# Altium schematic sheet SCH_LTDZXM-8814 _MCU20181113(1).SchDoc
size C; SheetNumber: 0; SheetTotal: 0; PageSetup: Record=PageOptions|CenterHorizontal=True|CenterVertical=True|PrintScale=1.00|XCorrection=1.00|YCorrection=1.00|PrintKind=0|BorderSize=5000000|LeftOffset=0|BottomOffset=0|Orientation=2|PaperLength=1000|PaperWidth=1000|Scale=100|PaperSource=7|PrintQuality=-4|MediaType=1|DitherType=10|PrintScaleMode=1|PaperKind=A4
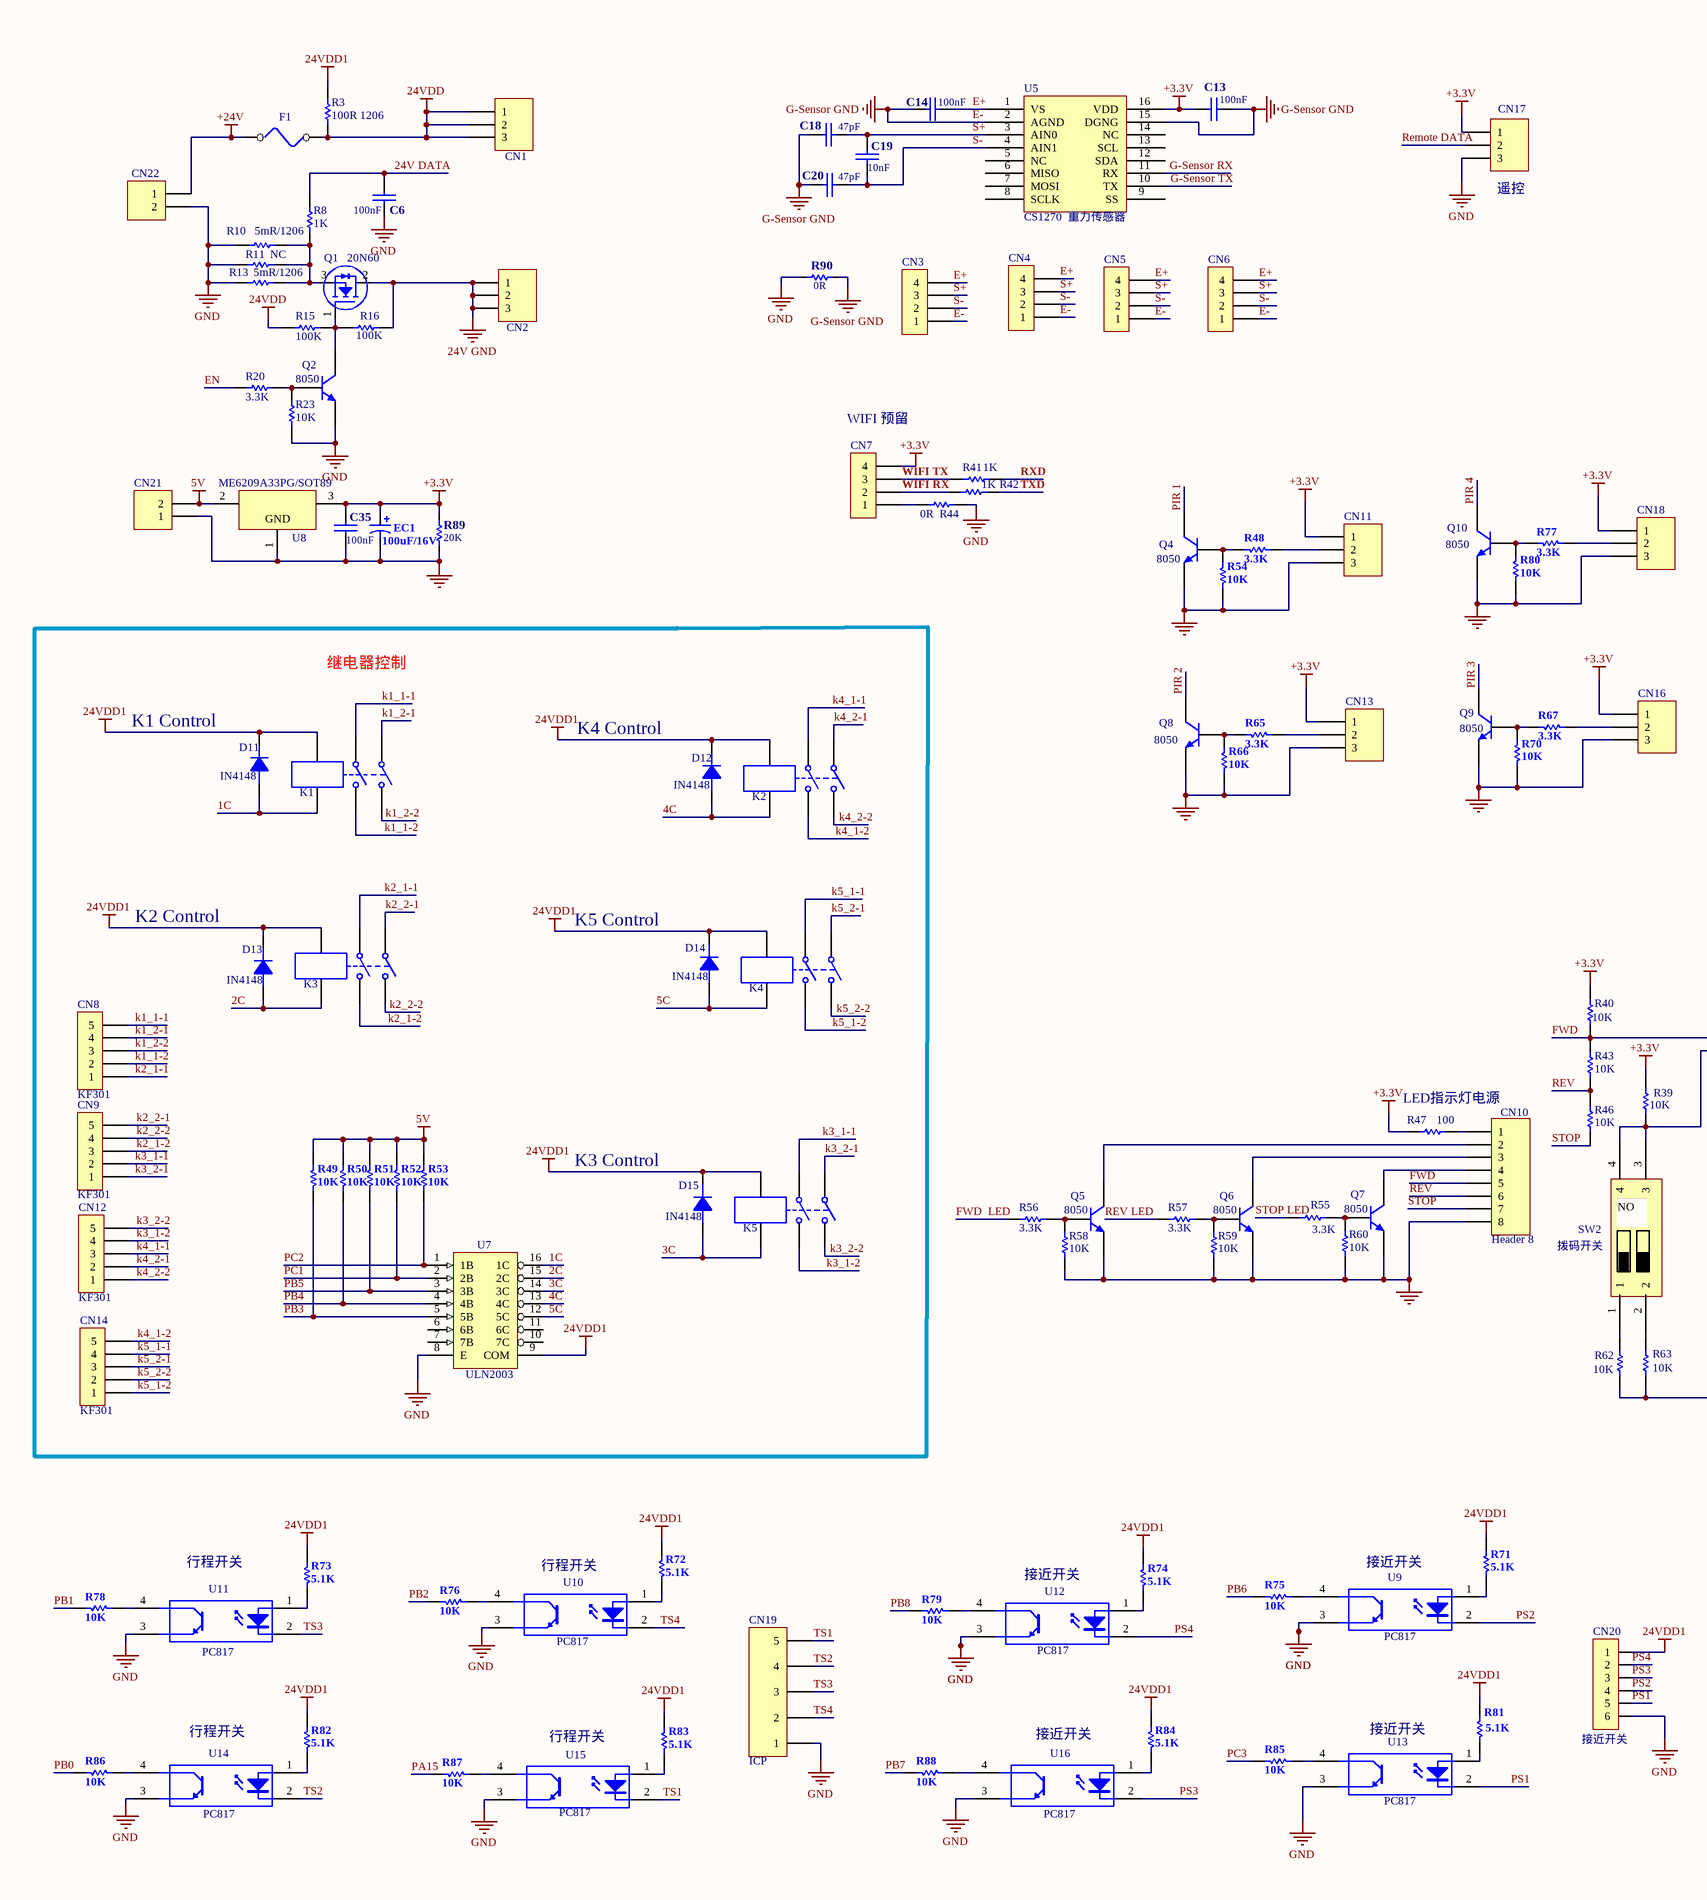
[diagram p0: SCH_LTDZXM-8814 _MCU20181113(1).SchDoc, left]
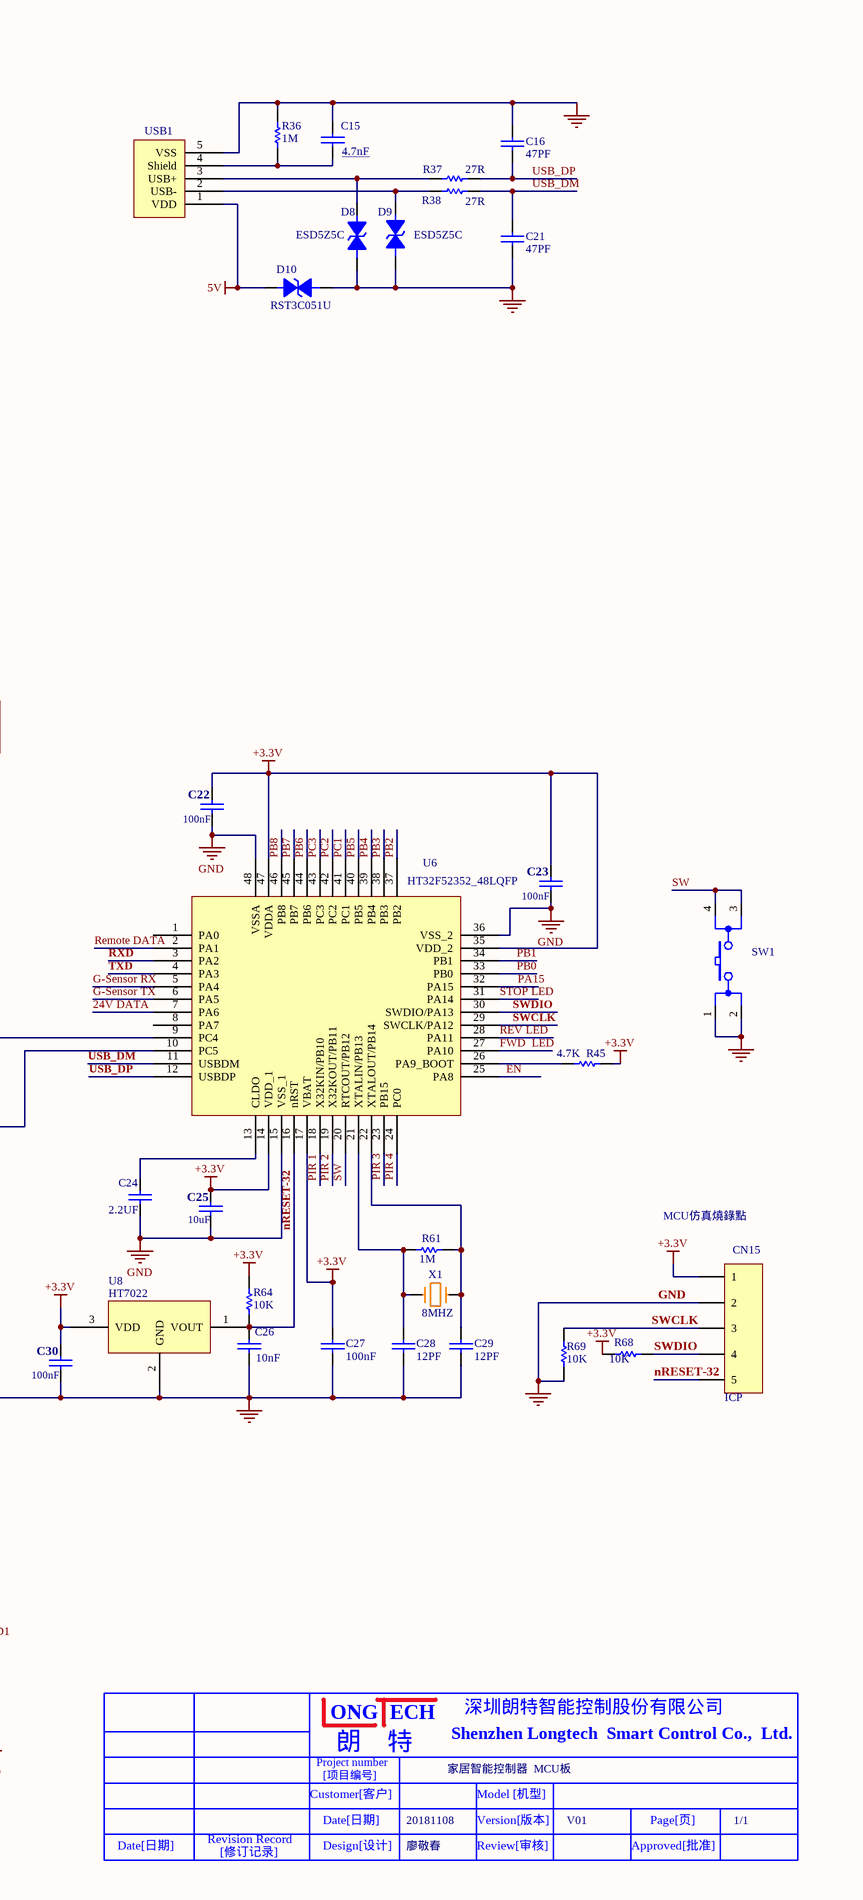
[diagram p1: SCH_LTDZXM-8814 _MCU20181113(1).SchDoc, right]

## Parts
(Parts that share a designator on the sheet are numbered #1, #2 ... from top to bottom, then left to right.)
3A_30V  F1  [RV 5.1mm]
C6  100nF  [SMD 0603C]
C13  100nF  [SMD 0603C]
C14  100nF  [SMD 0603C]
C15  4.7nF  [SMD 0603C]
C16  47PF  [SMD 0603C]
C18  47pF  [SMD 0603C]
C19  10nF  [SMD 0603C]
C20  47pF  [SMD 0603C]
C21  47PF  [SMD 0603C]
C22  100nF  [SMD 0603C]
C23  100nF  [SMD 0603C]
C24  2.2UF  [SMD 0603C]
C25  10uF  [SMD 0603C]
C26  10nF  [SMD 0603C]
C27  100nF  [SMD 0603C]
C28  12PF  [SMD 0603C]
C29  12PF  [SMD 0603C]
C30  100nF  [SMD 0603C]
C35  100nF  [SMD 0805CAP]
CN1  Header 3  [VH3.96-3P]  (value not drawn)
CN2  Header 3  [VH3.96-3P]  (value not drawn)
CN3  (no value)  [CON4-2.54]
CN4  (no value)  [CON4-2.54]
CN5  (no value)  [CON4-2.54]
CN6  (no value)  [CON4-2.54]
CN7  (no value)  [CON4-2.54]
CN8  KF301  [KF301-5P]
CN9  KF301  [KF301-5P]
CN10  Header 8  [XH2.54-8P]
CN11  Header 3  [XH2.54-3P]  (value not drawn)
CN12  KF301  [KF301-5P]
CN13  Header 3  [XH2.54-3P]  (value not drawn)
CN14  KF301  [KF301-5P]
CN15  ICP  [PH2.0-5P]
CN16  Header 3  [XH2.54-3P]  (value not drawn)
CN17  Header 3  [XH2.54-3P]  (value not drawn)
CN18  Header 3  [XH2.54-3P]  (value not drawn)
CN19  ICP  [XH2.54-5P]
CN20  接近开关  [XH2.54-6P]
CN21  Header 2  [XH2.54-2P]  (value not drawn)
CN22  Header 2  [VH3.96-2P]  (value not drawn)
D8  ESD5Z5C  [SOD-523]
D9  ESD5Z5C  [SOD-523]
D10  RST3C051U  [SOD-123]
D11  IN4148  [LL34]
D12  IN4148  [LL34]
D13  IN4148  [LL34]
D14  IN4148  [LL34]
D15  IN4148  [LL34]
EC1  100uF/16V  [CT 5*6 - C]
K1  单路双触点继电器  [JQX-14FC-2A_BK]  (value not drawn)
K2  单路双触点继电器  [JQX-14FC-2A_BK]  (value not drawn)
K3  单路双触点继电器  [JQX-14FC-2A_BK]  (value not drawn)
K4  单路双触点继电器  [JQX-14FC-2A_BK]  (value not drawn)
K5  单路双触点继电器  [JQX-14FC-2A_BK]  (value not drawn)
Q1  20N60  [TO-252A   MOS]
Q2  8050  [SOT-23 NPN]
Q4  8050  [SOT-23 NPN]
Q5  8050  [SOT-23 NPN]
Q6  8050  [SOT-23 NPN]
Q7  8050  [SOT-23 NPN]
Q8  8050  [SOT-23 NPN]
Q9  8050  [SOT-23 NPN]
Q10  8050  [SOT-23 NPN]
R3  100R 1206  [SMD 1206RES]
R8  1K  [SMD 0603RES]
R10  5mR/1206  [SMD 1206RES]
R11  NC  [SMD 1206RES]
R13  5mR/1206  [SMD 1206RES]
R15  100K  [SMD 0603RES]
R16  100K  [SMD 0603RES]
R20  3.3K  [SMD 0603RES]
R23  10K  [SMD 0603RES]
R36  1M  [SMD 0603RES]
R37  27R  [SMD 0603RES]
R38  27R  [SMD 0603RES]
R39  10K  [SMD 0603RES]
R40  10K  [SMD 0603RES]
R41  1K  [SMD 0603RES]
R42  1K  [SMD 0603RES]
R43  10K  [SMD 0603RES]
R44  0R  [SMD 0603RES]
R45  4.7K  [SMD 0603RES]
R46  10K  [SMD 0603RES]
R47  100  [SMD 0603RES]
R48  3.3K  [SMD 0603RES]
R49  10K  [SMD 0603RES]
R50  10K  [SMD 0603RES]
R51  10K  [SMD 0603RES]
R52  10K  [SMD 0603RES]
R53  10K  [SMD 0603RES]
R54  10K  [SMD 0603RES]
R55  3.3K  [SMD 0603RES]
R56  3.3K  [SMD 0603RES]
R57  3.3K  [SMD 0603RES]
R58  10K  [SMD 0603RES]
R59  10K  [SMD 0603RES]
R60  10K  [SMD 0603RES]
R61  1M  [SMD 0603RES]
R62  10K  [SMD 0603RES]
R63  10K  [SMD 0603RES]
R64  10K  [SMD 0603RES]
R65  3.3K  [SMD 0603RES]
R66  10K  [SMD 0603RES]
R67  3.3K  [SMD 0603RES]
R68  10K  [SMD 0603RES]
R69  10K  [SMD 0603RES]
R70  10K  [SMD 0603RES]
R71  5.1K  [SMD 0603RES]
R72  5.1K  [SMD 0603RES]
R73  5.1K  [SMD 0603RES]
R74  5.1K  [SMD 0603RES]
R75  10K  [SMD 0603RES]
R76  10K  [SMD 0603RES]
R77  3.3K  [SMD 0603RES]
R78  10K  [SMD 0603RES]
R79  10K  [SMD 0603RES]
R80  10K  [SMD 0603RES]
R81  5.1K  [SMD 0603RES]
R82  5.1K  [SMD 0603RES]
R83  5.1K  [SMD 0603RES]
R84  5.1K  [SMD 0603RES]
R85  10K  [SMD 0603RES]
R86  10K  [SMD 0603RES]
R87  10K  [SMD 0603RES]
R88  10K  [SMD 0603RES]
R89  20K  [SMD 1206RES]
R90  0R  [SMD 0805RES]
SW1  SW  [SMD SW6x6]  (value not drawn)
SW2  拨码开关  [DIP4-300]
U5  CS1270  重力传感器  [SOP16_N]
U6  HT32F52352_48LQFP  [LQFP48 7X7_M]
U7  ULN2003  [SOP16_M]
U8#1  ME6209A33PG/SOT89  [SOT-89]
U8#2  HT7022  [SOT-23-3 BTA54C]
U9  PC817  [PC817-SMT]
U10  PC817  [PC817-SMT]
U11  PC817  [PC817-SMT]
U12  PC817  [PC817-SMT]
U13  PC817  [PC817-SMT]
U14  PC817  [PC817-SMT]
U15  PC817  [PC817-SMT]
U16  PC817  [PC817-SMT]
USB1  CON USB 5PIN  [Micro USB]  (value not drawn)
X1  8MHZ  [XTAL5032]

## Nets
5V: CN21.2 D10.2(CATHODE) R49.1 R50.1 R51.1 R52.1 R53.1 U8#1.2(Vin) USB1.1(VDD)
24V GND: CN2.1 CN2.2 CN2.3 Q1.2(D) R16.1
24VDD: 3A_30V.2 CN1.1 CN1.2 CN1.3 R3.2 R15.2
24VDD1: CN20.1 D11.2(K) D12.2(K) D13.2(K) D14.2(K) D15.2(K) K1.8 K2.8 K3.8 K4.8 K5.8 R3.1 R71.2 R72.2 R73.2 R74.2 R81.2 R82.2 R83.2 R84.2 U7.9(COM)
+3.3V: C13.1 C22.1 C23.1 C25.1 C27.1 C30.1 C35.1 CN7.4 CN11.1 CN13.1 CN15.1 CN16.1 CN17.1 CN18.1 EC1.1 R39.2 R40.2 R45.2 R47.2 R64.1 R68.1 R89.1 U5.16(VDD) U6.14(VDD_1) U6.17(VBAT) U6.35(VDD_2) U6.47(VDDA) U8#1.3(Vout) U8#2.3(VDD)
+24V: 3A_30V.1 CN22.1
E-: C13.2 C14.1 C18.2 C20.2 CN3.1 CN4.1 CN5.1 CN6.1 R90.2 U5.2(AGND) U5.15(DGNG)  [also labelled G-Sensor GND]
GND: C6.1 C15.1 C16.1 C21.1 C22.2 C23.2 C24.1 C25.2 C26.2 C27.2 C28.2 C29.2 C30.2 C35.2 CN10.8 CN11.3 CN13.3 CN15.2 CN16.3 CN17.3 CN18.3 CN19.1 CN20.6 CN21.1 CN22.2 D8.1(ANODE) D9.1(ANODE) D10.1(ANODE) EC1.2 Q2.2(E) Q4.2(E) Q5.2(E) Q6.2(E) Q7.2(E) Q8.2(E) Q9.2(E) Q10.2(E) R10.2 R11.2 R13.2 R23.2 R36.1 R44.2 R54.2 R58.1 R59.1 R60.1 R62.2 R63.2 R66.2 R69.1 R70.2 R80.2 R89.2 R90.1 SW1.1 SW1.2 U6.15(VSS_1) U6.36(VSS_2) U6.48(VSSA) U7.8(E) U8#1.1(GND) U8#2.2(GND) U9.3(E) U10.3(E) U11.3(E) U12.3(E) U13.3(E) U14.3(E) U15.3(E) U16.3(E) USB1.5(VSS)
1C: D11.1(A) K1.1 U7.16(1C)
2C: D13.1(A) K3.1 U7.15(2C)
3C: D15.1(A) K5.1 U7.14(3C)
4C: D12.1(A) K2.1 U7.13(4C)
5C: D14.1(A) K4.1 U7.12(5C)
24V DATA: C6.2 R8.1 U6.7(PA6)
E+: C14.2 CN3.4 CN4.4 CN5.4 CN6.4 U5.1(VS)
EN: R20.1 U6.25(PA8)
FWD: CN10.5 R40.1 R43.2 U6.9(PC4)
FWD  LED: R56.1 U6.27(PA10)
G-Sensor RX: U5.11(RX) U6.5(PA4)
G-Sensor TX: U5.10(TX) U6.6(PA5)
k1_1-1: CN8.5 K1.6
k1_1-2: CN8.2 K1.3
k1_2-1: CN8.4 K1.5
k1_2-2: CN8.3 K1.4
k2_1-1: CN8.1 K3.6
k2_1-2: CN9.3 K3.3
k2_2-1: CN9.5 K3.5
k2_2-2: CN9.4 K3.4
k3_1-1: CN9.2 K5.6
k3_1-2: CN12.4 K5.3
k3_2-1: CN9.1 K5.5
k3_2-2: CN12.5 K5.4
k4_1-1: CN12.3 K2.6
k4_1-2: CN14.5 K2.3
k4_2-1: CN12.2 K2.5
k4_2-2: CN12.1 K2.4
k5_1-1: CN14.4 K4.6
k5_1-2: CN14.1 K4.3
k5_2-1: CN14.3 K4.5
k5_2-2: CN14.2 K4.4
nRESET-32: C26.1 CN15.5 R64.2 U6.16(nRST) U8#2.1(VOUT)
PA15: R87.2 U6.32(PA15)
PB0: R86.2 U6.33(PB0)
PB1: R78.2 U6.34(PB1)
PB2: R76.2 U6.37(PB2)
PB3: R49.2 U6.38(PB3) U7.5(5B)
PB4: R50.2 U6.39(PB4) U7.4(4B)
PB5: R51.2 U6.40(PB5) U7.3(3B)
PB6: R75.2 U6.44(PB6)
PB7: R88.2 U6.45(PB7)
PB8: R79.2 U6.46(PB8)
PC1: R52.2 U6.41(PC1) U7.2(2B)
PC2: R53.2 U6.42(PC2) U7.1(1B)
PC3: R85.2 U6.43(PC3)
PIR 1: Q4.3(C) U6.18(X32KIN/PB10)
PIR 2: Q8.3(C) U6.19(X32KOUT/PB11)
PIR 3: Q9.3(C) U6.23(PB15)
PIR 4: Q10.3(C) U6.24(PC0)
PS1: CN20.5 U13.2(K)
PS2: CN20.4 U9.2(K)
PS3: CN20.3 U16.2(K)
PS4: CN20.2 U12.2(K)
Remote DATA: CN17.2 U6.2(PA1)
REV: CN10.6 R43.1 R46.2
REV LED: R57.1 U6.28(PA11)
RXD: R41.2 U6.3(PA2)
S+: C18.1 C19.2 CN3.3 CN4.3 CN5.3 CN6.3 U5.3(AIN0)
S-: C19.1 C20.1 CN3.2 CN4.2 CN5.2 CN6.2 U5.4(AIN1)
STOP: CN10.7 R46.1
STOP LED: R55.1 U6.31(PA14)
SW: SW1.3 SW1.4 U6.20(RTCOUT/PB12)
SWCLK: CN15.3 R69.2 U6.29(SWCLK/PA12)
SWDIO: CN15.4 R68.2 U6.30(SWDIO/PA13)
TS1: CN19.5 U15.2(K)
TS2: CN19.4 U14.2(K)
TS3: CN19.3 U11.2(K)
TS4: CN19.2 U10.2(K)
TXD: R42.2 U6.4(PA3)
USB_DM: C21.2 R38.2 U6.11(USBDM)
USB_DP: C16.2 R37.2 U6.12(USBDP)
WIFI RX: CN7.2 R42.1
WIFI TX: CN7.3 R41.1
NetC15_2: C15.2 R36.2 USB1.4(Shield)
NetC24_2: C24.2 U6.13(CLDO)
NetC28_1: C28.1 R61.1 U6.21(XTALIN/PB13) X1.1
NetC29_1: C29.1 R61.2 U6.22(XTALOUT/PB14) X1.2
NetCN7_1: CN7.1 R44.1
NetCN10_1: CN10.1 R47.1
NetCN10_2: CN10.2 Q5.3(C)
NetCN10_3: CN10.3 Q6.3(C)
NetCN10_4: CN10.4 Q7.3(C)
NetCN11_2: CN11.2 R48.1
NetCN13_2: CN13.2 R65.1
NetCN16_2: CN16.2 R67.1
NetCN18_2: CN18.2 R77.1
NetD8_2: D8.2(CATHODE) R37.1 USB1.3(USB+)
NetD9_2: D9.2(CATHODE) R38.1 USB1.2(USB-)
NetQ1_1: Q1.1(G) Q2.3(C) R15.1 R16.2
NetQ1_3: Q1.3(S) R8.2 R10.1 R11.1 R13.1
NetQ2_1: Q2.1(B) R20.2 R23.1
NetQ4_1: Q4.1(B) R48.2 R54.1
NetQ5_1: Q5.1(B) R56.2 R58.2
NetQ6_1: Q6.1(B) R57.2 R59.2
NetQ7_1: Q7.1(B) R55.2 R60.2
NetQ8_1: Q8.1(B) R65.2 R66.1
NetQ9_1: Q9.1(B) R67.2 R70.1
NetQ10_1: Q10.1(B) R77.2 R80.1
NetR39_1: R39.1 SW2.3 SW2.4 U6.10(PC5)
NetR45_1: R45.1 U6.26(PA9_BOOT)
NetR62_1: R62.1 SW2.1
NetR63_1: R63.1 SW2.2
NetR71_1: R71.1 U9.1(A)
NetR72_1: R72.1 U10.1(A)
NetR73_1: R73.1 U11.1(A)
NetR74_1: R74.1 U12.1(A)
NetR75_1: R75.1 U9.4(C)
NetR76_1: R76.1 U10.4(C)
NetR78_1: R78.1 U11.4(C)
NetR79_1: R79.1 U12.4(C)
NetR81_1: R81.1 U13.1(A)
NetR82_1: R82.1 U14.1(A)
NetR83_1: R83.1 U15.1(A)
NetR84_1: R84.1 U16.1(A)
NetR85_1: R85.1 U13.4(C)
NetR86_1: R86.1 U14.4(C)
NetR87_1: R87.1 U15.4(C)
NetR88_1: R88.1 U16.4(C)

Not connected (* = marked no-connect by the designer): U5 5(NC) 6(MISO) 7(MOSI) 8(SCLK) 9(SS) 12(SDA) 13(SCL) 14(NC); U6 1(PA0) 8(PA7); U7 6(6B) 7(7B) 10(7C) 11(6C)

## Notes on the sheet
- (near CN17) 遥控
- (near CN7) WIFI 预留
- 继电器控制
- (near D11) K1 Control
- (near D12) K4 Control
- (near D13) K2 Control
- (near D14) K5 Control
- (near R47) LED指示灯电源
- (near D15) K3 Control
- MCU仿真燒錄點
- (near U11) 行程开关
- (near U10) 行程开关
- (near U12) 接近开关
- (near U9) 接近开关
- (near U13) 接近开关
- ONG
- ECH
- 深圳朗特智能控制股份有限公司
- (near U14) 行程开关
- (near U15) 行程开关
- (near U16) 接近开关
- Customer[客户]
- Project number
- [项目编号]
- 朗    特
- 家居智能控制器  MCU板
- Shenzhen Longtech  Smart Control Co.,  Ltd.
- Model [机型]
- Date[日期]
- Revision Record
- [修订记录]
- Design[设计]
- 廖敬春
- 20181108
- Version[版本]
- Review[审核]
- V01
- Approved[批准]
- Page[页]
- 1/1
- (in symbol 拨码开关) NO

## Library data of the parts
3A_30V = FUSE
C6 C13-C16 C18-C30 C35 = CAP
CN1 CN2 CN11 CN13 CN16-CN18 = Header 3: Header, 3-Pin; LatestRevisionDate: 17-Jul-2002; LatestRevisionNote: Re-released for DXP Platform.; Publisher: Altium Limited
CN3-CN7 = CON4-2.54mm
CN8 CN9 CN12 CN14 = CON5-2.54mm
CN10 = Header 8: Header, 8-Pin; LatestRevisionDate: 17-Jul-2002; LatestRevisionNote: Re-released for DXP Platform.; Publisher: Altium Limited
CN15 CN19 = CON5: Connector
CN20 = CON6PIN2.0
CN21 CN22 = Header 2: Header, 2-Pin; Manufacturer: Generic Components; Class: Connector
D8-D10 = TVS
D11-D15 = diode
EC1 = Cap Pol1: Polarized Capacitor (Radial); Published: *; LatestRevisionDate: *; LatestRevisionNote: *; Publisher: *; Value: *
Q1 = NMOS  TO252
Q2 Q4-Q10 = NPN S
R3 R8 R10 R11 R13 R15 R16 R20 R23 R36-R47 R55-R64 R68 R69 = RES1: Resistor
R48-R54 R65-R67 R70-R90 = Res1: Resistor; Published: 8-Jun-2000; Publisher: Altium Limited; LatestRevisionDate: 17-Jul-2002; LatestRevisionNote: Re-released for DXP Platform.
  R89 R90: PackageReference: AXIAL-0.3
SW1 = Double touch switch
U6 = HT32F52342_48LQFP
U7 = ULN2003-2: 达林顿驱动芯片; 版权归属: 源创客; BOM名称: 达林顿驱动芯片; 学习资源: www.ooocke.com
U8#1 = Volt Reg: Voltage Regulator; Published: 24-Mar-1999; LatestRevisionDate: 17-Jul-2002; LatestRevisionNote: Re-released for DXP Platform.; PackageReference: D2PAK; Publisher: Altium Limited; Code_JEDEC: SMD-220
U9-U16 = 光耦 - OPTOISO1
X1 = CRYSTAL1